# EAGLE design Base ultasonico (EAGLE 7.6.0)
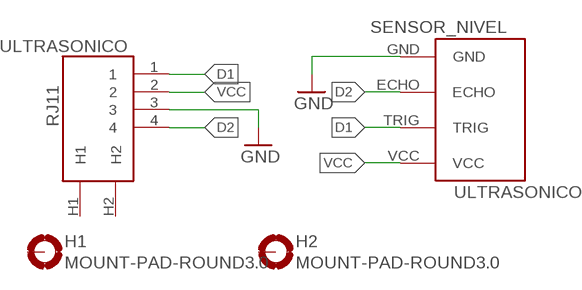
[diagram p0: schematic, sheet 1]

## Parts
H1  MOUNT-PAD-ROUND3.0  [3,0-PAD]
H2  MOUNT-PAD-ROUND3.0  [3,0-PAD]
SENSOR_NIVEL  ULTRASONICO  [ULTRASONICO]
ULTRASONICO  RJ11  [RJ11]

## Nets
D1: SENSOR_NIVEL.TRIG ULTRASONICO.1
D2: SENSOR_NIVEL.ECHO ULTRASONICO.4
GND: SENSOR_NIVEL.GND ULTRASONICO.3
VCC: SENSOR_NIVEL.VCC ULTRASONICO.2
Unconnected: H1.B3,0(MOUNT) H2.B3,0(MOUNT) ULTRASONICO.H1 ULTRASONICO.H2

## Library data of the parts
H1 H2 = holes:MOUNT-PAD-ROUND: MOUNTING PAD, round
SENSOR_NIVEL = CONECTORES RODAS:ULTRASONICO
ULTRASONICO = CONECTORES RODAS:RJ11

## Board
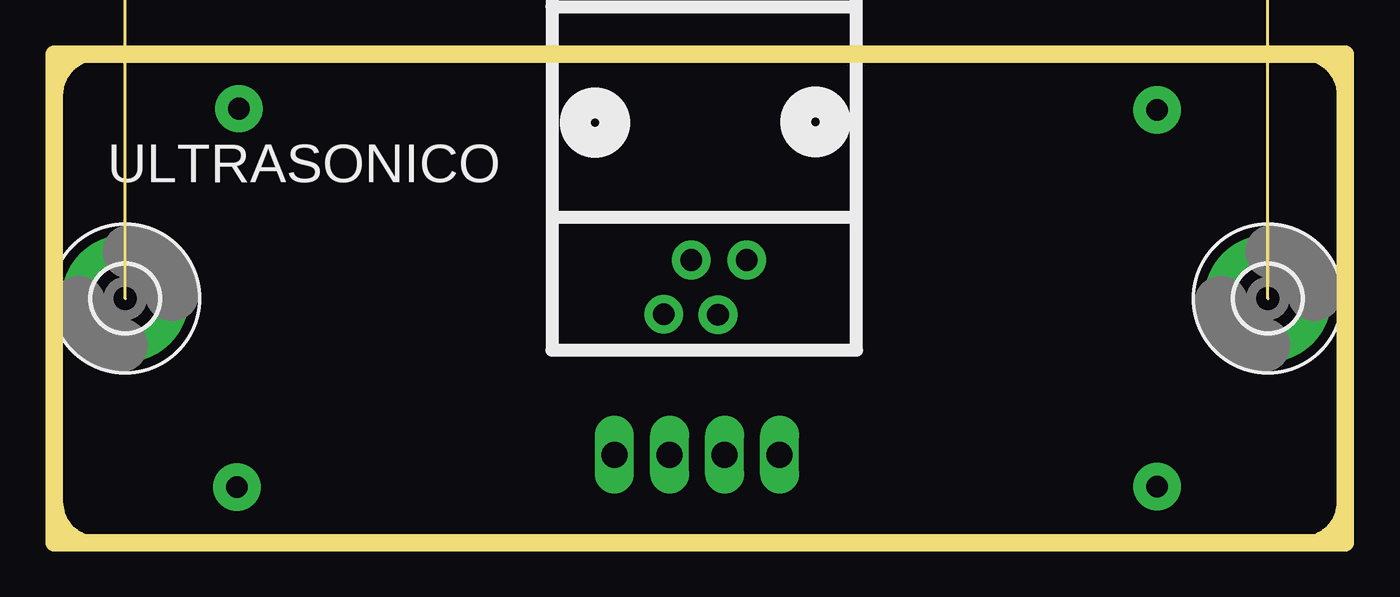
[diagram p1: board, top side]
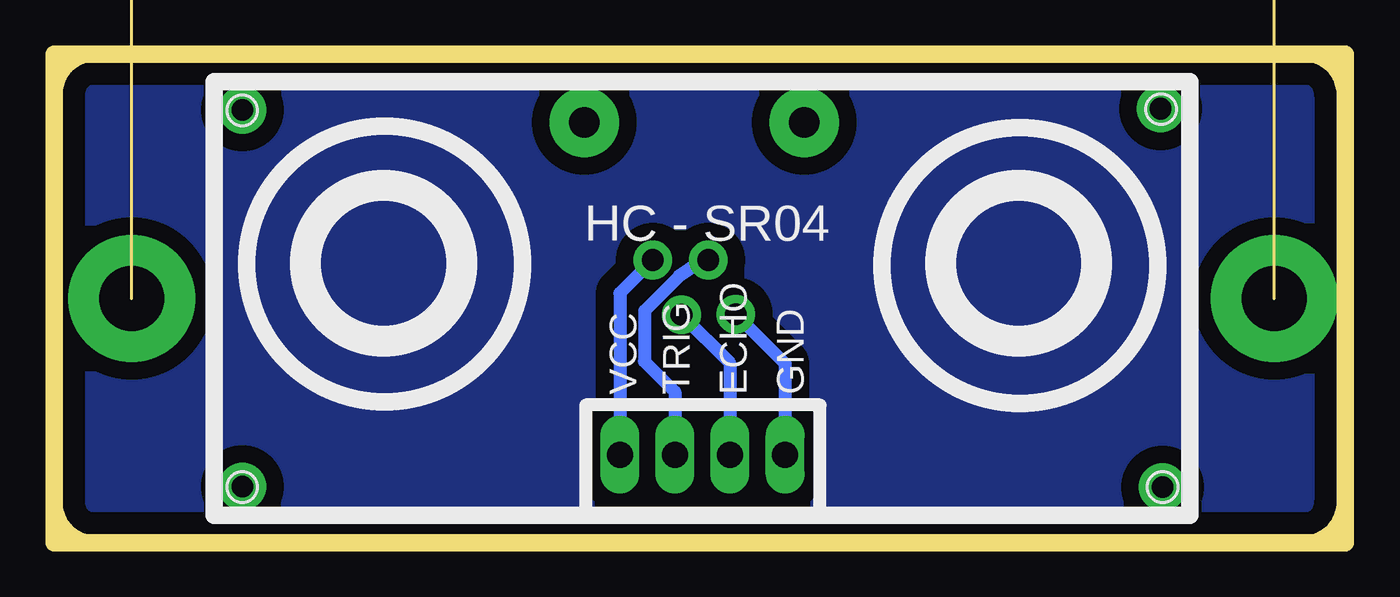
[diagram p2: board, bottom side, seen from below]

Size 59.56 x 22.54 mm. Coordinates in mm from the lower left corner, seen from the top.
Outline: 2.01,0 0,0 0,22.53 59.56,22.53 59.56,0 57.57,0
Outline: 2.01,0 57.57,0
Outline: 0.1,2.54 0.1,1.9 arc90 2.01,0
Outline: 2.01,22.54 arc90 0.1,20.64
Outline: 59.48,20.64 arc90 57.57,22.54
Outline: 57.57,0 arc90 59.48,1.9
Copper layers (1*16): Top 0.035mm / dielectric 1.5mm / Bottom 0.035mm
Design rules "default": minimum track width 10mil, minimum drill 24mil, track to track 8mil, track to pad 8mil, pad to pad 8mil, via to via 8mil, smd to smd 8mil, copper to edge 40mil, drill to drill 8mil, minimum pad ring 10mil, minimum via ring 8mil, stop-mask expansion 4mil, vias tented up to drill 0mil, thermal gap 10mil
Milling: area 3.3,30.6 to 4.8,31.2; area 54.5,30.6 to 56,31.2; area 26.9,31.3 to 32.4,33; 3 lines

### Footprints (pad centres in the part's own frame; a part is rotated, then mirrored left to right if it is on the bottom)
3,0-PAD = drill 3 pad 5.842: B3,0 0,0
ULTRASONICO = drill 1.2 pad 1.778 long: ECHO 23.786,2.784; GND 26.326,2.784; TRIG 21.246,2.784; VCC 18.706,2.784
RJ11 = drill 1 pad 1.778: 1 6.426,4.153; 2 8.979,4.153; 3 5.156,1.651; 4 7.658,1.626 | drill 1.4 pad 3.2: H1 1.994,10.503; H2 12.141,10.503

### Placement (x,y rotation side)
H1  55.98,11.27 0 top
H2  3.28,11.27 0 top
SENSOR_NIVEL  52.17,1.27 0 bottom
ULTRASONICO  22.96,8.89 0 top

### Tracks (layer width: path | path; a pad name or v marks a point on that pad's centre or on a via)
D1
  Bottom 0.61: ULTRASONICO.1 29.83,12.9 30.72,12.3 32.32,10.7 32.33,8.37 30.93,6.97 SENSOR_NIVEL.TRIG
D2
  Bottom 0.61: ULTRASONICO.4 28.39,8.28 SENSOR_NIVEL.ECHO
GND
  Bottom 0.61: ULTRASONICO.3 25.85,8.27 SENSOR_NIVEL.GND
N$1  (via drill 1 pad 2.18)
  other vias: 8.53,20.03
N$2  (via drill 1 pad 2.18)
  other vias: 8.43,2.56
N$5  (via drill 1 pad 2.18)
  other vias: 50.88,2.58
N$6  (via drill 1 pad 2.18)
  other vias: 50.88,19.97
N$7
  pour Bottom (isolate 0.813): 0.27,0.28 59.58,0.28 59.58,22.26 0.04,22.26 0.04,1.69
VCC
  Bottom 0.61: ULTRASONICO.2 33.47,11.52 SENSOR_NIVEL.VCC